# Altium schematic sheet Axel.SchDoc
size A4
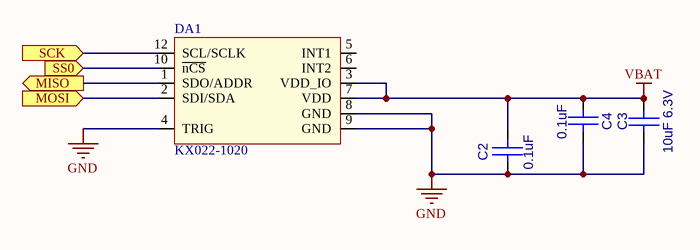
[diagram p0: Axel.SchDoc]

## Parts
C2  0.1uF  [CC0603]
C3  10uF 6.3V  [CC0805]
C4  0.1uF  [CC0603]
DA1  KX022-1020  [LGA-12]

## Ports
MISO (out), MOSI (in), SCK (in), SS0 (in)

## Nets
GND: C2.2(B) C3.1(A) C4.2(B) DA1.4(TRIG) DA1.8(GND) DA1.9(GND)
VBAT: C2.1(A) C3.2(B) C4.1(A) DA1.3(VDD_IO) DA1.7(VDD)
MISO: DA1.1(SDO/ADDR) ; port MISO
MOSI: DA1.2(SDI/SDA) ; port MOSI
SCK: DA1.12(SCL/SCLK) ; port SCK
SS0: DA1.10(~{nCS}) ; port SS0

Not connected (* = marked no-connect by the designer): DA1 5(INT1) 6(INT2)

## Library data of the parts
C2 C4 = CC0603: Value: 0.1uF
C3 = CC0805: Value: 10uF 6.3V
DA1 = KX022-1020: Value: KX022-1020